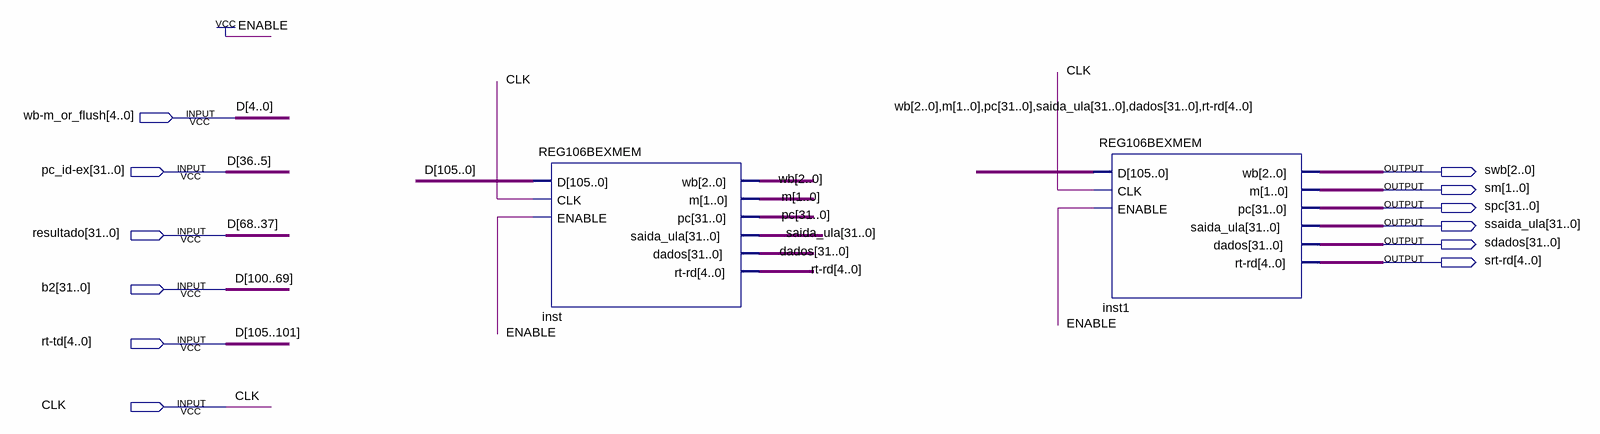
[diagram p0: schematic sheet]
// Quartus schematic EX-MEM.bdf as structural Verilog: 2 symbols, 12 pins
module \EX-MEM  (
  input  [4:0] \wb-m_or_flush ,
  input  [31:0] \pc_id-ex ,
  input  [31:0] resultado,
  input  [31:0] b2,
  input  [4:0] \rt-td ,
  input  CLK,
  output [2:0] swb,
  output [1:0] sm,
  output [31:0] spc,
  output [31:0] ssaida_ula,
  output [31:0] sdados,
  output [4:0] \srt-rd 
);

  wire [1:0] m;
  wire [2:0] wb;
  wire [4:0] \rt-rd ;
  wire [31:0] dados, pc, saida_ula;

  REG106BEXMEM inst (
    .D({\rt-td , b2, resultado, \pc_id-ex , \wb-m_or_flush }), .CLK(CLK), .ENABLE(1'b1), .wb(wb), .m(m),
    .pc(pc), .saida_ula(saida_ula), .dados(dados), .\rt-rd (\rt-rd ));
  REG106BEXMEM inst1 (
    .D({wb, m, pc, saida_ula, dados, \rt-rd }), .CLK(CLK), .ENABLE(1'b1), .wb(swb), .m(sm), .pc(spc),
    .saida_ula(ssaida_ula), .dados(sdados), .\rt-rd (\srt-rd ));

  // Other names for the same wires on the sheet: D[105:0] = {\rt-td , b2, resultado, \pc_id-ex , \wb-m_or_flush }
endmodule
